# Altium schematic sheet [06] - INPUT.SchDoc
size A3; DocumentNumber: 6; SheetNumber: 6; SheetTotal: 9
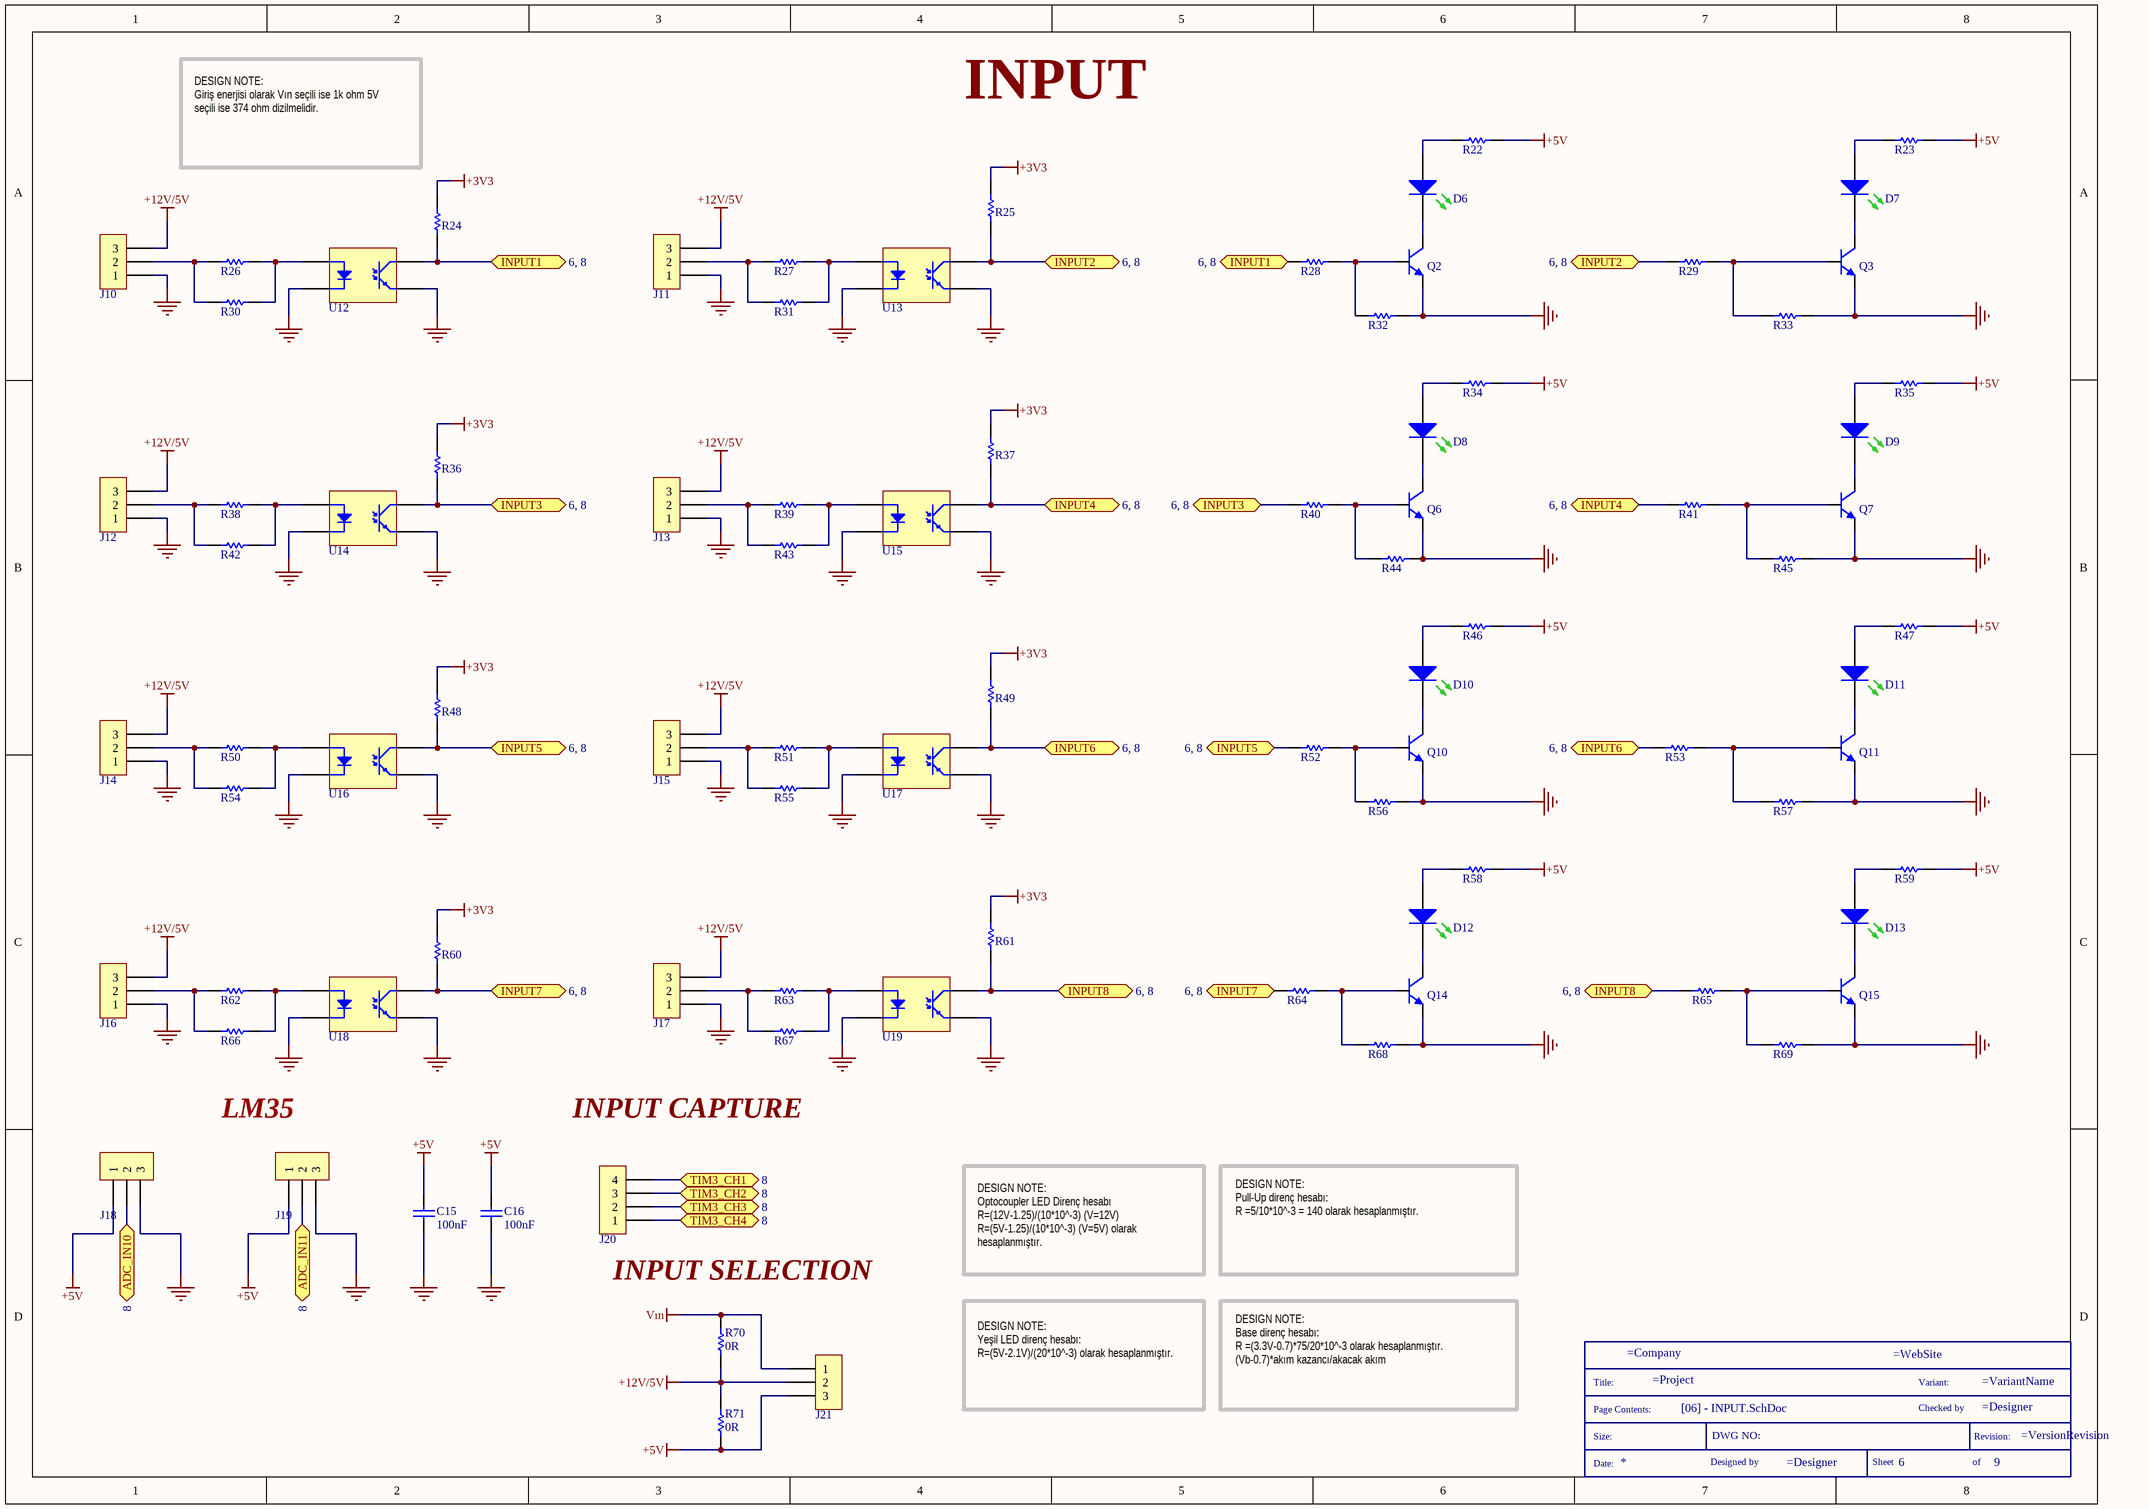
[diagram p0: [06] - INPUT.SchDoc]

## Parts
*  SCH_TITLE  (value not drawn)  (graphical)
C15  100nF  [C0603]
C16  100nF  [C0603]
D6  LED GREEN  [PLCC2]  (value not drawn)
D7  LED GREEN  [PLCC2]  (value not drawn)
D8  LED GREEN  [PLCC2]  (value not drawn)
D9  LED GREEN  [PLCC2]  (value not drawn)
D10  LED GREEN  [PLCC2]  (value not drawn)
D11  LED GREEN  [PLCC2]  (value not drawn)
D12  LED GREEN  [PLCC2]  (value not drawn)
D13  LED GREEN  [PLCC2]  (value not drawn)
J10  CONN 1X3 3MM  [CONN_MALE_1X3_3MM]  (value not drawn)
J11  CONN 1X3 3MM  [CONN_MALE_1X3_3MM]  (value not drawn)
J12  CONN 1X3 3MM  [CONN_MALE_1X3_3MM]  (value not drawn)
J13  CONN 1X3 3MM  [CONN_MALE_1X3_3MM]  (value not drawn)
J14  CONN 1X3 3MM  [CONN_MALE_1X3_3MM]  (value not drawn)
J15  CONN 1X3 3MM  [CONN_MALE_1X3_3MM]  (value not drawn)
J16  CONN 1X3 3MM  [CONN_MALE_1X3_3MM]  (value not drawn)
J17  CONN 1X3 3MM  [CONN_MALE_1X3_3MM]  (value not drawn)
J18  HDR_1X3_2.54  [HDR_MALE_1X3_2.54MM]  (value not drawn)
J19  HDR_1X3_2.54  [HDR_MALE_1X3_2.54MM]  (value not drawn)
J20  HDR FEMALE 1X4 2.54MM  [HDR_FEMALE_1X4_2.54MM]  (value not drawn)
J21  HDR_1X3_2.54  [HDR_MALE_1X3_2.54MM]  (value not drawn)
Q2  NPN 0.6A  [SOT-23 (TO-236)]  (value not drawn)
Q3  NPN 0.6A  [SOT-23 (TO-236)]  (value not drawn)
Q6  NPN 0.6A  [SOT-23 (TO-236)]  (value not drawn)
Q7  NPN 0.6A  [SOT-23 (TO-236)]  (value not drawn)
Q10  NPN 0.6A  [SOT-23 (TO-236)]  (value not drawn)
Q11  NPN 0.6A  [SOT-23 (TO-236)]  (value not drawn)
Q14  NPN 0.6A  [SOT-23 (TO-236)]  (value not drawn)
Q15  NPN 0.6A  [SOT-23 (TO-236)]  (value not drawn)
R22  140 1/8W  [RES_0805]  (value not drawn)
R23  140 1/8W  [RES_0805]  (value not drawn)
R24  5.6k 1/8W  [RES_0805]  (value not drawn)
R25  5.6k 1/8W  [RES_0805]  (value not drawn)
R26  1K 1/8W  [RES_0805]  (value not drawn)
R27  1K 1/8W  [RES_0805]  (value not drawn)
R28  10K 1/8W  [RES_0805]  (value not drawn)
R29  10K 1/8W  [RES_0805]  (value not drawn)
R30  374 1/8W  [RES_0805]  (value not drawn)
R31  374 1/8W  [RES_0805]  (value not drawn)
R32  100K 1/4W  [RES_0603]  (value not drawn)
R33  100K 1/4W  [RES_0603]  (value not drawn)
R34  140 1/8W  [RES_0805]  (value not drawn)
R35  140 1/8W  [RES_0805]  (value not drawn)
R36  5.6k 1/8W  [RES_0805]  (value not drawn)
R37  5.6k 1/8W  [RES_0805]  (value not drawn)
R38  1K 1/8W  [RES_0805]  (value not drawn)
R39  1K 1/8W  [RES_0805]  (value not drawn)
R40  10K 1/8W  [RES_0805]  (value not drawn)
R41  10K 1/8W  [RES_0805]  (value not drawn)
R42  374 1/8W  [RES_0805]  (value not drawn)
R43  374 1/8W  [RES_0805]  (value not drawn)
R44  100K 1/4W  [RES_0603]  (value not drawn)
R45  100K 1/4W  [RES_0603]  (value not drawn)
R46  140 1/8W  [RES_0805]  (value not drawn)
R47  140 1/8W  [RES_0805]  (value not drawn)
R48  5.6k 1/8W  [RES_0805]  (value not drawn)
R49  5.6k 1/8W  [RES_0805]  (value not drawn)
R50  1K 1/8W  [RES_0805]  (value not drawn)
R51  1K 1/8W  [RES_0805]  (value not drawn)
R52  10K 1/8W  [RES_0805]  (value not drawn)
R53  10K 1/8W  [RES_0805]  (value not drawn)
R54  374 1/8W  [RES_0805]  (value not drawn)
R55  374 1/8W  [RES_0805]  (value not drawn)
R56  100K 1/4W  [RES_0603]  (value not drawn)
R57  100K 1/4W  [RES_0603]  (value not drawn)
R58  140 1/8W  [RES_0805]  (value not drawn)
R59  140 1/8W  [RES_0805]  (value not drawn)
R60  5.6k 1/8W  [RES_0805]  (value not drawn)
R61  5.6k 1/8W  [RES_0805]  (value not drawn)
R62  1K 1/8W  [RES_0805]  (value not drawn)
R63  1K 1/8W  [RES_0805]  (value not drawn)
R64  10K 1/8W  [RES_0805]  (value not drawn)
R65  10K 1/8W  [RES_0805]  (value not drawn)
R66  374 1/8W  [RES_0805]  (value not drawn)
R67  374 1/8W  [RES_0805]  (value not drawn)
R68  100K 1/4W  [RES_0603]  (value not drawn)
R69  100K 1/4W  [RES_0603]  (value not drawn)
R70  0R  [R0805]
R71  0R  [R0805]
U12  NPN 3.75KV  [SOIC-6]  (value not drawn)
U13  NPN 3.75KV  [SOIC-6]  (value not drawn)
U14  NPN 3.75KV  [SOIC-6]  (value not drawn)
U15  NPN 3.75KV  [SOIC-6]  (value not drawn)
U16  NPN 3.75KV  [SOIC-6]  (value not drawn)
U17  NPN 3.75KV  [SOIC-6]  (value not drawn)
U18  NPN 3.75KV  [SOIC-6]  (value not drawn)
U19  NPN 3.75KV  [SOIC-6]  (value not drawn)

## Ports
ADC_IN10 (see 8), ADC_IN11 (see 8), INPUT1 (see 6, 8), INPUT2 (see 6, 8), INPUT3 (see 6, 8), INPUT4 (see 6, 8), INPUT5 (see 6, 8), INPUT6 (see 6, 8), INPUT7 (see 6, 8), INPUT8 (see 6, 8), TIM3_CH1 (see 8), TIM3_CH2 (see 8), TIM3_CH3 (see 8), TIM3_CH4 (see 8)

## Nets
+3V3: R24.2 R25.2 R36.2 R37.2 R48.2 R49.2 R60.2 R61.2
+5V: C15.2 C16.2 J18.1 J19.1 J21.3 R22.2 R23.2 R34.2 R35.2 R46.2 R47.2 R58.2 R59.2 R71.1
+12V/5V: J10.3 J11.3 J12.3 J13.3 J14.3 J15.3 J16.3 J17.3 J21.2 R70.1 R71.2
GND: C15.1 C16.1 J10.1 J11.1 J12.1 J13.1 J14.1 J15.1 J16.1 J17.1 J18.3 J19.3 Q2.3(E) Q3.3(E) Q6.3(E) Q7.3(E) Q10.3(E) Q11.3(E) Q14.3(E) Q15.3(E) R32.2 R33.2 R44.2 R45.2 R56.2 R57.2 R68.2 R69.2 U12.3(K) U12.4(Emit) U13.3(K) U13.4(Emit) U14.3(K) U14.4(Emit) U15.3(K) U15.4(Emit) U16.3(K) U16.4(Emit) U17.3(K) U17.4(Emit) U18.3(K) U18.4(Emit) U19.3(K) U19.4(Emit)
Vın: J21.1 R70.2
ADC_IN10: J18.2 ; port ADC_IN10
ADC_IN11: J19.2 ; port ADC_IN11
INPUT1: R24.1 R28.1 U12.6(Coll) ; port INPUT1
INPUT2: R25.1 R29.1 U13.6(Coll) ; port INPUT2
INPUT3: R36.1 R40.1 U14.6(Coll) ; port INPUT3
INPUT4: R37.1 R41.1 U15.6(Coll) ; port INPUT4
INPUT5: R48.1 R52.1 U16.6(Coll) ; port INPUT5
INPUT6: R49.1 R53.1 U17.6(Coll) ; port INPUT6
INPUT7: R60.1 R64.1 U18.6(Coll) ; port INPUT7
INPUT8: R61.1 R65.1 U19.6(Coll) ; port INPUT8
TIM3_CH1: J20.4 ; port TIM3_CH1
TIM3_CH2: J20.3 ; port TIM3_CH2
TIM3_CH3: J20.2 ; port TIM3_CH3
TIM3_CH4: J20.1 ; port TIM3_CH4
NetD6_1: D6.1(A) R22.1
NetD6_2: D6.2(K) Q2.1(C)
NetD7_1: D7.1(A) R23.1
NetD7_2: D7.2(K) Q3.1(C)
NetD8_1: D8.1(A) R34.1
NetD8_2: D8.2(K) Q6.1(C)
NetD9_1: D9.1(A) R35.1
NetD9_2: D9.2(K) Q7.1(C)
NetD10_1: D10.1(A) R46.1
NetD10_2: D10.2(K) Q10.1(C)
NetD11_1: D11.1(A) R47.1
NetD11_2: D11.2(K) Q11.1(C)
NetD12_1: D12.1(A) R58.1
NetD12_2: D12.2(K) Q14.1(C)
NetD13_1: D13.1(A) R59.1
NetD13_2: D13.2(K) Q15.1(C)
NetJ10_2: J10.2 R26.1 R30.1
NetJ11_2: J11.2 R27.1 R31.1
NetJ12_2: J12.2 R38.1 R42.1
NetJ13_2: J13.2 R39.1 R43.1
NetJ14_2: J14.2 R50.1 R54.1
NetJ15_2: J15.2 R51.1 R55.1
NetJ16_2: J16.2 R62.1 R66.1
NetJ17_2: J17.2 R63.1 R67.1
NetQ2_2: Q2.2(B) R28.2 R32.1
NetQ3_2: Q3.2(B) R29.2 R33.1
NetQ6_2: Q6.2(B) R40.2 R44.1
NetQ7_2: Q7.2(B) R41.2 R45.1
NetQ10_2: Q10.2(B) R52.2 R56.1
NetQ11_2: Q11.2(B) R53.2 R57.1
NetQ14_2: Q14.2(B) R64.2 R68.1
NetQ15_2: Q15.2(B) R65.2 R69.1
NetR26_2: R26.2 R30.2 U12.1(A)
NetR27_2: R27.2 R31.2 U13.1(A)
NetR38_2: R38.2 R42.2 U14.1(A)
NetR39_2: R39.2 R43.2 U15.1(A)
NetR50_2: R50.2 R54.2 U16.1(A)
NetR51_2: R51.2 R55.2 U17.1(A)
NetR62_2: R62.2 R66.2 U18.1(A)
NetR63_2: R63.2 R67.2 U19.1(A)

## Notes on the sheet
- INPUT
- DESIGN NOTE:
  Giriş enerjisi olarak Vın seçili ise 1k ohm 5V seçili ise 374 ohm dizilmelidir.
- LM35
- INPUT CAPTURE
- DESIGN NOTE:
  Optocoupler LED Direnç hesabı
  R=(12V-1.25)/(10*10^-3) (V=12V)
  R=(5V-1.25)/(10*10^-3) (V=5V) olarak hesaplanmıştır.
- DESIGN NOTE:
  Pull-Up direnç hesabı:
  R =5/10*10^-3 = 140 olarak hesaplanmıştır.
- INPUT SELECTION
- DESIGN NOTE:
  Yeşil LED direnç hesabı:
  R=(5V-2.1V)/(20*10^-3) olarak hesaplanmıştır.
- DESIGN NOTE:
  Base direnç hesabı:
  R =(3.3V-0.7)*75/20*10^-3 olarak hesaplanmıştır.
  (Vb-0.7)*akım kazancı/akacak akım
- (in symbol SCH_TITLE) Title:; Variant:; Page Contents:; Checked by; Size:; DWG NO:; Revision:; Date:; Designed by; Sheet; of

## Library data of the parts
* = SCH_TITLE: Schematic information
C15 C16 = CGA3E2X7R1E104K080AA: CAP CER 0.1UF 25V X7R 0603; Manufacturer 1: TDK Corporation; Category: Ceramic Capacitors; Manufacturer Part Number 1: CGA3E2X7R1E104K080AA; Case/Package: 0603 (1608 Metric); Quantity: 1; Supplier 1: Digikey; Supplier Stock 1: 1909079; Supplier Part Number 1: 445-5667-1-ND; Supplier Order Qty 1: 1; Supplier Unit Price 1: 0,10; Supplier Currency 1: $
D6-D13 = LP T67F-P1R2-35-1-20-R18-Z: LED TOPLED GREEN 562NM 2PLCC; Manufacturer 1: OSRAM Opto Semiconductors Inc.; Category: LED Lighting - Color; Manufacturer Part Number 1: LP T67F-P1R2-35-1-20-R18-Z; Case/Package: 2-PLCC; Quantity: 1; Supplier 1: Digikey; Supplier Part Number 1: 475-3760-1-ND; Supplier Order Qty 1: 1; Supplier Stock 1: 1903; Supplier Unit Price 1: 0,67; Supplier Currency 1: $
J10-J17 = 66200311122: CONN MALE 1X3 3MM; Manufacturer 1: Wurth Electronics Inc.; Category: Rectangular Connectors - Headers, Male Pins; Manufacturer Part Number 1: 66200311122; Case/Package: 3POS_3mmPitch; Quantity: 1; Supplier 1: Digikey; Supplier Part Number 1: 732-4709-5-ND; Supplier Order Qty 1: 1; Supplier Stock 1: 56; Supplier Unit Price 1: 0,34; Supplier Currency 1: $
J18 J19 J21 = 61300311121: HDR MALE 1X3 2.54MM; Manufacturer 1: Wurth Electronics Inc.; Category: Rectangular Connectors - Headers, Male Pins; Manufacturer Part Number 1: 61300311121; Case/Package: 3POS pitch 2.54mm; Quantity: 1; Supplier 1: Digikey; Supplier Part Number 1: 732-5316-ND; Supplier Order Qty 1: 1; Supplier Stock 1: 109116; Supplier Unit Price 1: 0,13; Supplier Currency 1: $
J20 = PPTC041LFBN-RC: Manufacturer 1: Sullins Connector Solutions; Category: Rectangular Connectors - Headers, Receptacles, Female Sockets; Case/Package: 4POS_2.54mmPitch; Manufacturer Part Number 1: PPTC041LFBN-RC; Quantity: 1; Supplier 1: Digikey; Supplier Part Number 1: S7002-ND; Supplier Order Qty 1: 1; Supplier Stock 1: 30769; Supplier Unit Price 1: 0,45; Supplier Currency 1: $
Q2 Q3 Q6 Q7 Q10 Q11 Q14 Q15 = MMBT2222A-7-F: TRANS NPN 40V 0.6A SMD SOT23-3; Manufacturer 1: Diodes Incorporated; Category: Transistors - Bipolar (BJT) - Single; Manufacturer Part Number 1: MMBT2222A-7-F; Case/Package: SOT-23-3; Quantity: 1; Supplier 1: Digikey; Supplier Part Number 1: MMBT2222A-FDICT-ND; Supplier Order Qty 1: 1; Supplier Stock 1: 1957039; Supplier Unit Price 1: 0,14; Supplier Currency 1: $
R22 R23 R34 R35 R46 R47 R58 R59 = ERJ-6ENF1400V: RES SMD 140 OHM 1% 1/8W 0805; Manufacturer 1: Panasonic Electronic Components; Category: Chip Resistor - Surface Mount; Manufacturer Part Number 1: ERJ-6ENF1400V; Case/Package: 0805 (2012 Metric); Quantity: 1; Supplier 1: Digikey; Supplier Part Number 1: P140CCT-ND; Supplier Order Qty 1: 1; Supplier Stock 1: 76818; Supplier Unit Price 1: 0,1; Supplier Currency 1: $
R24 R25 R36 R37 R48 R49 R60 R61 = ERJ-6ENF5601V: RES SMD 5.6K OHM 1% 1/8W 0805; Manufacturer 1: Panasonic Electronic Components; Category: Chip Resistor - Surface Mount; Manufacturer Part Number 1: ERJ-6ENF5601V; Case/Package: 0805 (2012 Metric); Quantity: 1; Supplier 1: Digikey; Supplier Part Number 1: P5.60KCCT-ND; Supplier Order Qty 1: 1; Supplier Stock 1: 71341; Supplier Unit Price 1: 0,1; Supplier Currency 1: $
R26 R27 R38 R39 R50 R51 R62 R63 = ERJ-6ENF1001V: RES SMD 1K OHM; Manufacturer 1: Panasonic Electronic Components; Category: Chip Resistor - Surface Mount; Manufacturer Part Number 1: ERJ-6ENF1001V; Case/Package: 0805 (2012 Metric); Quantity: 1; Supplier 1: Digikey; Supplier Part Number 1: P1.00KCCT-ND; Supplier Order Qty 1: 1; Supplier Stock 1: 1361018; Supplier Unit Price 1: 0,1; Supplier Currency 1: $
R28 R29 R40 R41 R52 R53 R64 R65 = ERJ-6ENF1002V: RES SMD 10K OHM 1% 1/8W 0805; Manufacturer 1: Panasonic Electronic Components; Category: Chip Resistor - Surface Mount; Manufacturer Part Number 1: ERJ-6ENF1002V; Case/Package: 0805 (2012 Metric); Quantity: 1; Supplier 1: Digikey; Supplier Part Number 1: P10.0KCCT-ND; Supplier Order Qty 1: 1; Supplier Stock 1: 2515107; Supplier Unit Price 1: 0,1; Supplier Currency 1: $
R30 R31 R42 R43 R54 R55 R66 R67 = ERJ-6ENF3740V: RES SMD 374 OHM 1% 1/8W 0805; Manufacturer 1: Panasonic Electronic Components; Category: Chip Resistor - Surface Mount; Manufacturer Part Number 1: ERJ-6ENF3740V; Case/Package: 0805 (2012 Metric); Quantity: 1; Supplier 1: Digikey; Supplier Order Qty 1: 1; Supplier Stock 1: 100272; Supplier Unit Price 1: 0,1; Supplier Currency 1: $; Supplier Part Number 1: P374CCT-ND
R32 R33 R44 R45 R56 R57 R68 R69 = ERJ-PA3J104V: RES SMD 100K 5% 1/4W 0603; Manufacturer 1: Panasonic Electronic Components; Category: Chip Resistor - Surface Mount; Manufacturer Part Number 1: ERJ-PA3J104V; Case/Package: 0603 (1608 Metric); Quantity: 1; Supplier 1: Digikey; Supplier Part Number 1: P100KBZCT-ND; Supplier Order Qty 1: 1; Supplier Stock 1: 11465; Supplier Unit Price 1: 0,11; Supplier Currency 1: $
R70 R71 = CRCW08050000Z0EA: RES SMD 0 OHM JUMPER 1/8W 0805; Manufacturer 1: Vishay Dale; Category: Chip Resistor - Surface Mount; Manufacturer Part Number 1: CRCW08050000Z0EA; Case/Package: 0805 (2012 Metric); Quantity: 1; Supplier 1: Digikey; Supplier Part Number 1: 541-0.0ACT-ND; Supplier Order Qty 1: 1; Supplier Stock 1: 609778; Supplier Unit Price 1: 0,10; Supplier Currency 1: $
U12-U19 = TLP2301(TPL,E: OPTOISO 3.75KV TRANS; Manufacturer 1: Toshiba Semiconductor and Storage; Category: Optoisolators - Transistor, Photovoltaic Output; Manufacturer Part Number 1: TLP2301(TPL,E; Case/Package: 6-SOIC (0.179", 4.55mm Width), 4 Leads; Quantity: 1; Supplier 1: Digikey; Supplier Part Number 1: TLP2301(TPLECT-ND; Supplier Order Qty 1: 1; Supplier Stock 1: 19225; Supplier Unit Price 1: 0,73; Supplier Currency 1: $